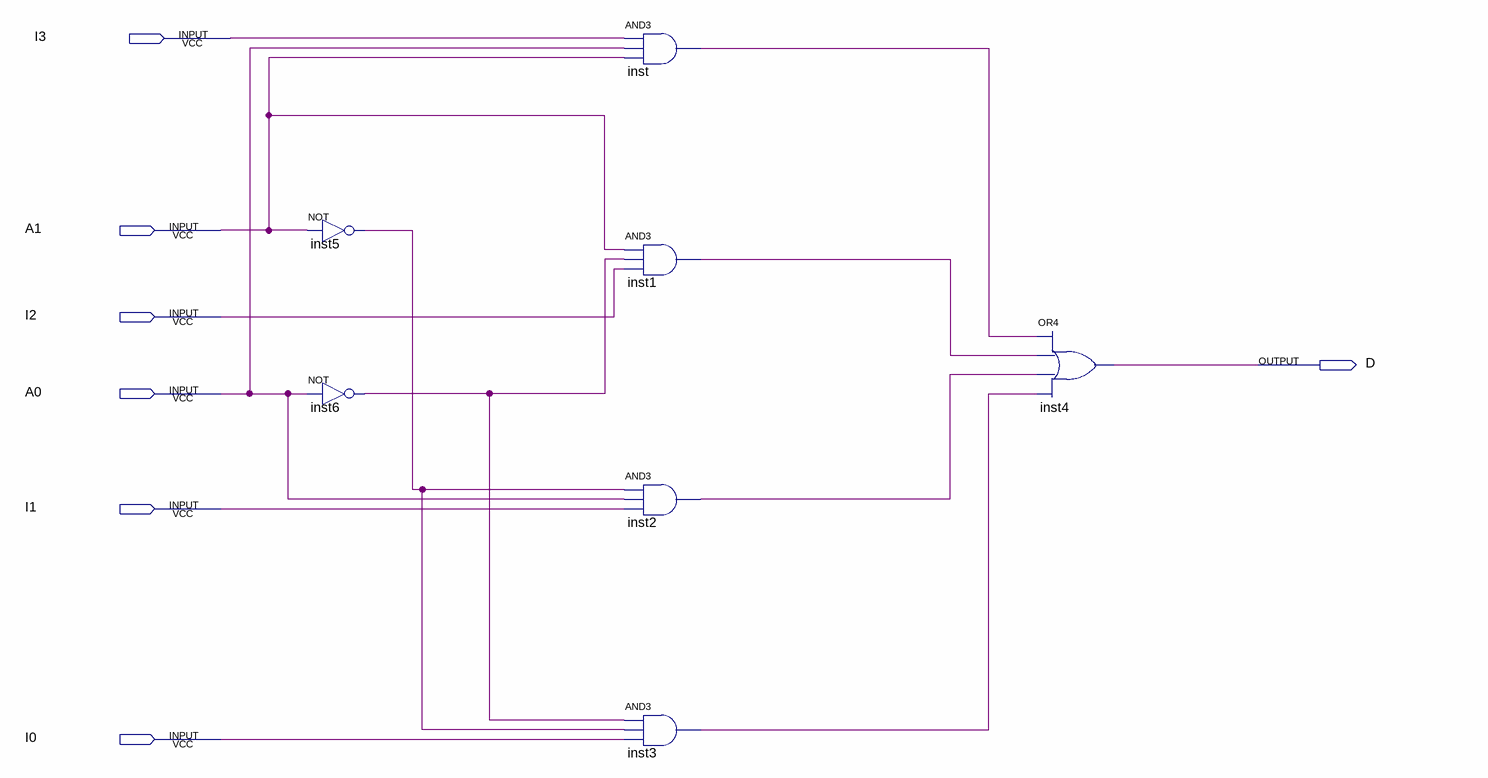
[diagram p0: schematic sheet]
// Quartus schematic Exercise2.bdf as structural Verilog: 7 symbols, 7 pins
module Exercise2 (
  input  I3,
  input  A1,
  input  I2,
  input  A0,
  input  I1,
  input  I0,
  output D
);

  wire inst1_out, inst2_out, inst3_out, inst5_out, inst6_out, inst_out;

  not inst5 (inst5_out, A1);
  not inst6 (inst6_out, A0);
  and inst (inst_out, I3, A0, A1);
  and inst1 (inst1_out, A1, inst6_out, I2);
  and inst2 (inst2_out, inst5_out, A0, I1);
  and inst3 (inst3_out, inst6_out, inst5_out, I0);
  or inst4 (D, inst_out, inst1_out, inst2_out, inst3_out);
endmodule
